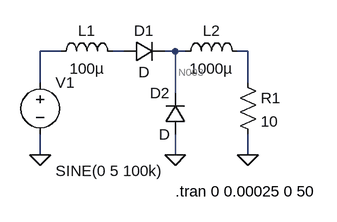
[diagram p0: schematic lecture_3_load_regulation.asc]
lecture_3_load_regulation.asc, the LTspice schematic file:
Version 4
SHEET 1 880 680
WIRE 80 64 48 64
WIRE 176 64 160 64
WIRE 256 64 240 64
WIRE 272 64 256 64
WIRE 368 64 352 64
WIRE 48 112 48 64
WIRE 368 112 368 64
WIRE 256 128 256 64
WIRE 48 224 48 192
WIRE 256 224 256 192
WIRE 368 224 368 192
FLAG 48 224 0
FLAG 256 224 0
FLAG 368 224 0
SYMBOL voltage 48 96 R0
WINDOW 3 24 152 Left 2
WINDOW 123 24 124 Left 2
WINDOW 39 0 0 Left 0
SYMATTR InstName V1
SYMATTR Value SINE(0 5 100k)
SYMBOL ind 64 80 R270
WINDOW 0 32 56 VTop 2
WINDOW 3 5 56 VBottom 2
SYMATTR InstName L1
SYMATTR Value 100µ
SYMBOL diode 176 80 R270
WINDOW 0 32 32 VTop 2
WINDOW 3 0 32 VBottom 2
SYMATTR InstName D1
SYMBOL diode 272 192 R180
WINDOW 0 24 64 Left 2
WINDOW 3 24 0 Left 2
SYMATTR InstName D2
SYMBOL ind 256 80 R270
WINDOW 0 32 56 VTop 2
WINDOW 3 5 56 VBottom 2
SYMATTR InstName L2
SYMATTR Value 1000µ
SYMBOL res 352 96 R0
SYMATTR InstName R1
SYMATTR Value 10
TEXT 256 280 Left 2 !.tran 0 0.00025 0 50

The netlist it stands for:
* lecture_3_load_regulation.asc
V1 N001 0 SINE(0 5 100k)
L1 N001 N002 100µ
D1 N002 N003 D
D2 0 N003 D
L2 N003 N004 1000µ
R1 N004 0 10
.model D D
.lib standard.dio
.tran 0 0.00025 0 50
.backanno
.end

* Results of the author's LTspice run, read from the files saved beside the schematic
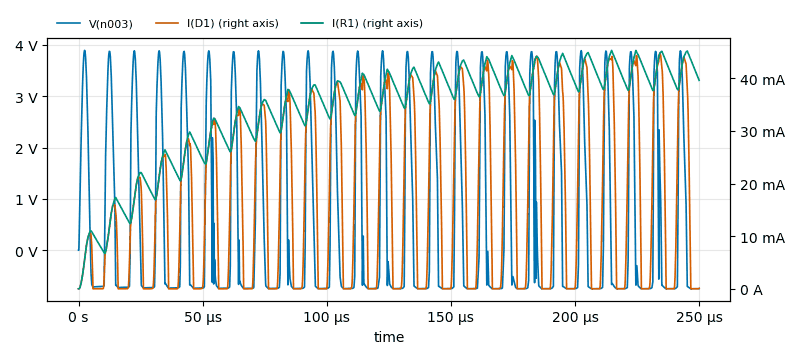
[diagram p1: Transient Analysis of lecture_3_load_regulation.asc, plotted from the saved traces]
* Transient Analysis, 1 run:
*   V(n003): min -752.7 mV, max 3.895 V, average 461.1 mV, rms 1.823 V, last -750.2 mV
*   I(D1): min 0 A, max 44.75 mA, average 17.06 mA, rms 23.95 mA, last 82.3 µA
*   I(R1): min 0 A, max 45.29 mA, average 33.99 mA, rms 35.35 mA, last 39.6 mA